# Altium schematic sheet AUDIO.SchDoc: Наименование
size 209 x 297 mm; ApprovedBy: Утвердил; CheckedBy: Проверил; Author: Разработал; CompanyName: Организация; DrawnBy: Н.Контр; Engineer: Т.Контр; SheetNumber: 1; SheetTotal: 1; PageSetup: Record=PageOptions|CenterHorizontal=True|CenterVertical=True|PrintScale=0.94|XCorrection=1.00|YCorrection=1.00|PrintKind=1|BorderSize=5000000|LeftOffset=0|BottomOffset=0|Orientation=1|PaperLength=1000|PaperWidth=1000|Scale=100|PaperSource=7|PrintQuality=-4|MediaType=1|DitherType=10|PaperKind=A4|PrintScaleMode=1; DecimalNumber: Децимальный номер; HeadOfSector: Нач. сектора; MainDevice: Перв.примен.; Name: Наименование; DocumentName: Sheet1.SCHDOC
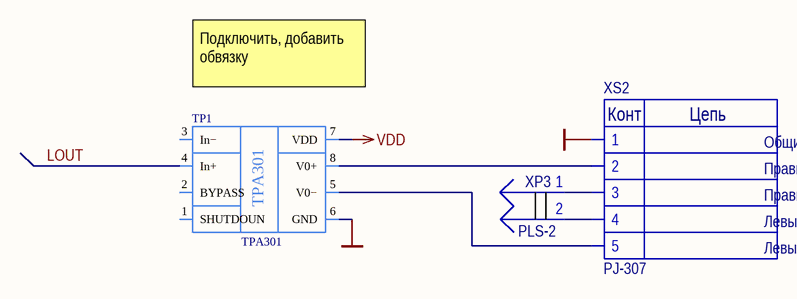
[diagram p0: AUDIO.SchDoc]

## Parts
TP1  TPA301  [TPA301 TSOP65P490X110_HS-9L]
XP3  PLS-2  [PLS-2]
XS2  PJ-307  [PJ-307]

## Nets
GND: TP1.6(GND) XS2.1
VDD: TP1.7(VDD)
LOUT: TP1.4(In+)
NetTP1_5: TP1.5(V0−) XS2.5
NetTP1_8: TP1.8(V0+) XS2.2
NetXP3_1: XP3.1 XS2.3
NetXP3_2: XP3.2 XS2.4

Not connected (* = marked no-connect by the designer): TP1 1(SHUTDOUN) 2(BYPASS) 3(In−)

## Notes on the sheet
- (near TP1) Подключить, добавить обвязку
- Подп. и дата
- Инв.№ дубл.
- Взам.инв.№
- Подп.и дата
- Инв.№ подл.
- Изм.
- Лист
- № докум.
- Подп.
- Дата
- Формат  A4
- (in symbol PJ-307) Конт; Цепь; Общий; Правый; Правый - динамик; Левый - динамик; Левый